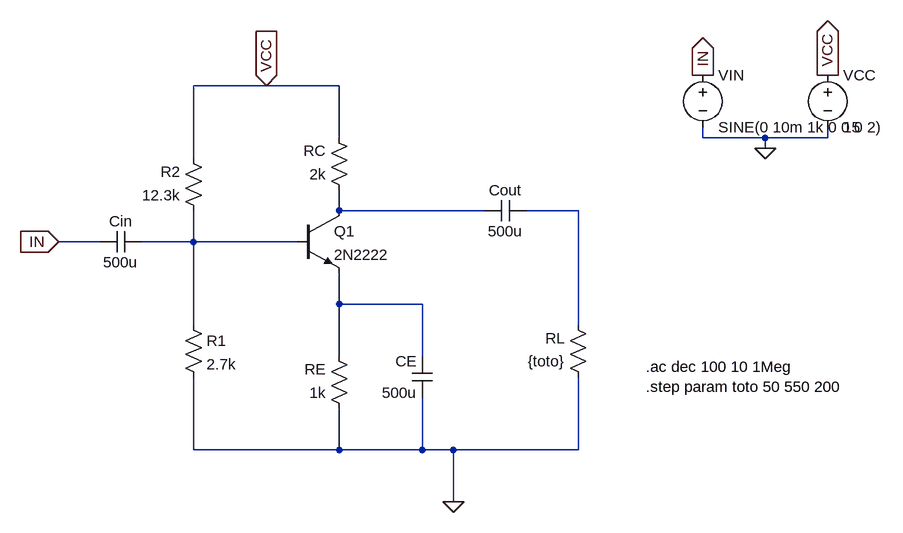
[diagram p0: schematic amplificateur_bipolaire.asc]
amplificateur_bipolaire.asc, the LTspice schematic file:
Version 4
SHEET 1 1072 704
WIRE 112 48 0 48
WIRE 224 48 112 48
WIRE 224 128 224 48
WIRE 784 128 784 112
WIRE 880 128 784 128
WIRE 976 128 976 112
WIRE 976 128 880 128
WIRE 880 144 880 128
WIRE 0 160 0 48
WIRE 224 240 224 208
WIRE 448 240 224 240
WIRE 592 240 512 240
WIRE -144 288 -208 288
WIRE 0 288 0 240
WIRE 0 288 -80 288
WIRE 160 288 0 288
WIRE 224 384 224 336
WIRE 352 384 224 384
WIRE 0 416 0 288
WIRE 592 416 592 240
WIRE 224 464 224 384
WIRE 352 464 352 384
WIRE 0 608 0 496
WIRE 224 608 224 544
WIRE 224 608 0 608
WIRE 352 608 352 528
WIRE 352 608 224 608
WIRE 400 608 352 608
WIRE 592 608 592 496
WIRE 592 608 400 608
WIRE 400 688 400 608
FLAG 400 688 0
FLAG 880 144 0
FLAG 784 32 IN
IOPIN 784 32 Out
FLAG 976 32 VCC
IOPIN 976 32 Out
FLAG -208 288 IN
IOPIN -208 288 In
FLAG 112 48 VCC
IOPIN 112 48 In
SYMBOL npn 160 240 R0
SYMATTR InstName Q1
SYMATTR Value 2N2222
SYMBOL res 16 256 R180
WINDOW 0 36 76 Left 2
WINDOW 3 36 40 Left 2
SYMATTR InstName R2
SYMATTR Value 12.3k
SYMBOL res 240 224 R180
WINDOW 0 36 76 Left 2
WINDOW 3 36 40 Left 2
SYMATTR InstName RC
SYMATTR Value 2k
SYMBOL res 240 560 R180
WINDOW 0 36 76 Left 2
WINDOW 3 36 40 Left 2
SYMATTR InstName RE
SYMATTR Value 1k
SYMBOL res 608 512 R180
WINDOW 0 36 76 Left 2
WINDOW 3 36 40 Left 2
SYMATTR InstName RL
SYMATTR Value {toto}
SYMBOL res -16 400 R0
SYMATTR InstName R1
SYMATTR Value 2.7k
SYMBOL cap -80 272 R90
WINDOW 0 0 32 VBottom 2
WINDOW 3 32 32 VTop 2
SYMATTR InstName Cin
SYMATTR Value 500u
SYMBOL cap 368 528 R180
WINDOW 0 24 56 Left 2
WINDOW 3 24 8 Left 2
SYMATTR InstName CE
SYMATTR Value 500u
SYMBOL cap 448 256 R270
WINDOW 0 32 32 VTop 2
WINDOW 3 0 32 VBottom 2
SYMATTR InstName Cout
SYMATTR Value 500u
SYMBOL voltage 784 16 R0
SYMATTR InstName VIN
SYMATTR Value SINE(0 10m 1k 0 0 0 2)
SYMATTR Value2 AC 1
SYMBOL voltage 976 16 R0
SYMATTR InstName VCC
SYMATTR Value 15
TEXT 696 480 Left 2 !.ac dec 100 10 1Meg\n.step param toto 50 550 200

The netlist it stands for:
* amplificateur_bipolaire.asc
Q1 N001 N003 N004 0 2N2222
R2 N003 VCC 12.3k
RC N001 VCC 2k
RE 0 N004 1k
RL 0 N002 {toto}
R1 N003 0 2.7k
Cin N003 IN 500u
CE 0 N004 500u
Cout N001 N002 500u
VIN IN 0 SINE(0 10m 1k 0 0 0 2) AC 1
VCC VCC 0 15
.model NPN NPN
.model PNP PNP
.lib standard.bjt
.ac dec 100 10 1Meg
.step param toto 50 550 200
.backanno
.end